# EasyEDA Pro project CL_LFR_V2.epro

# Schematic Schematic2
Board Name: Board1; Create Date: 2025-03-08; Page Name: P1; Project Name: LFR_RobotV2_PCB; Schematic Name: Schematic2; Update Date: 2025-03-08; Company: EasyEDA.com; Page Size: A4; Version: V1.0
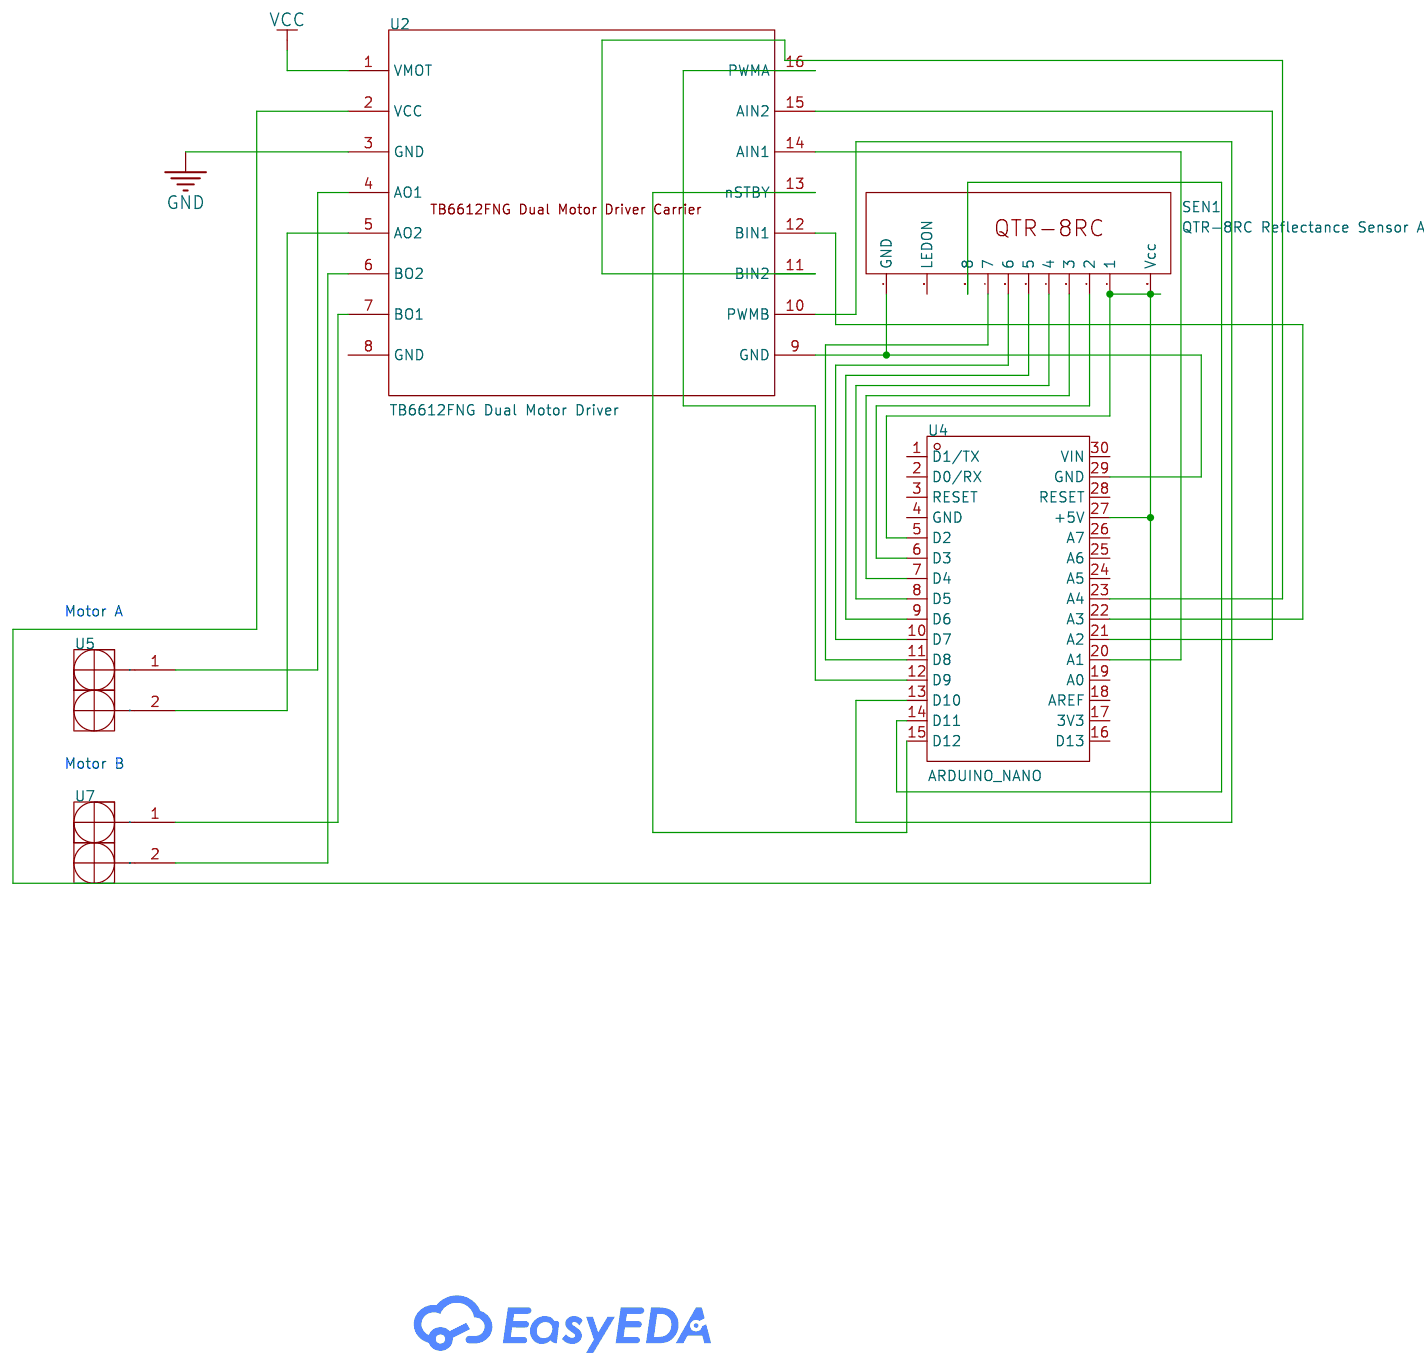
[diagram p0: schematic sheet]

## Parts
SEN1  QTR-8RC Reflectance Sensor Array  [QTR-8X]
U2  TB6612FNG Dual Motor Driver  [TB6612FNG]
U4  ARDUINO_NANO  [COMM-TH_ARDUINO_NANO]
U5  -  [2PIN SCREW TERMINAL]
U7  -  [2PIN SCREW TERMINAL]

## Library data of the parts
SEN1 = QTR-8RC Reflectance Sensor Array: Manufacturer: Pololu; Supplier: Pololu; Supplier Part: 961; link: https://www.pololu.com/product/961
U2 = TB6612FNG Dual Motor Driver: Mounted: Yes
U4 = ARDUINO_NANO: Supplier Part: C9900017879; Supplier Footprint: 插件; JLCPCB Part Class: Extended Part; Supplier: LCSC
U5 U7 = 2PIN SCREW TERMINAL

## Nets
GND: U2.3(GND)
VCC: U2.1(VMOT)
Net-(SEN1-1): SEN1.1 SEN1.10(Vcc) U2.2(VCC) U4.5(D2) U4.27(+5V)
Net-(SEN1-2): SEN1.2 U4.6(D3)
Net-(SEN1-3): SEN1.3 U4.7(D4)
Net-(SEN1-4): SEN1.4 U4.8(D5)
Net-(SEN1-5): SEN1.5 U4.9(D6)
Net-(SEN1-6): SEN1.6 U4.10(D7)
Net-(SEN1-7): SEN1.7 U4.11(D8)
Net-(SEN1-8): SEN1.8 U4.14(D11)
Net-(SEN1-11): SEN1.11(GND) U2.9(GND) U4.29(GND)
Net-(U2-4): U2.4(AO1) U5.1
Net-(U2-5): U2.5(AO2) U5.2
Net-(U2-6): U2.6(BO2) U7.2
Net-(U2-7): U2.7(BO1) U7.1
Net-(U2-10): U2.10(PWMB) U4.13(D10)
Net-(U2-11): U2.11(BIN2) U4.23(A4)
Net-(U2-12): U2.12(BIN1) U4.22(A3)
Net-(U2-13): U2.13(nSTBY) U4.15(D12)
Net-(U2-14): U2.14(AIN1) U4.20(A1)
Net-(U2-15): U2.15(AIN2) U4.21(A2)
Net-(U2-16): U2.16(PWMA) U4.12(D9)

Not connected (* = marked no-connect by the designer): SEN1 9(LEDON); U2 8(GND); U4 1(D1/TX) 2(D0/RX) 3(RESET) 4(GND) 16(D13) 17(3V3) 18(AREF) 19(A0) 24(A5) 25(A6) 26(A7) 28(RESET) 30(VIN)

## Notes on the sheet
- Motor A
- Motor B

# Board LFR_RobotV2_PCB
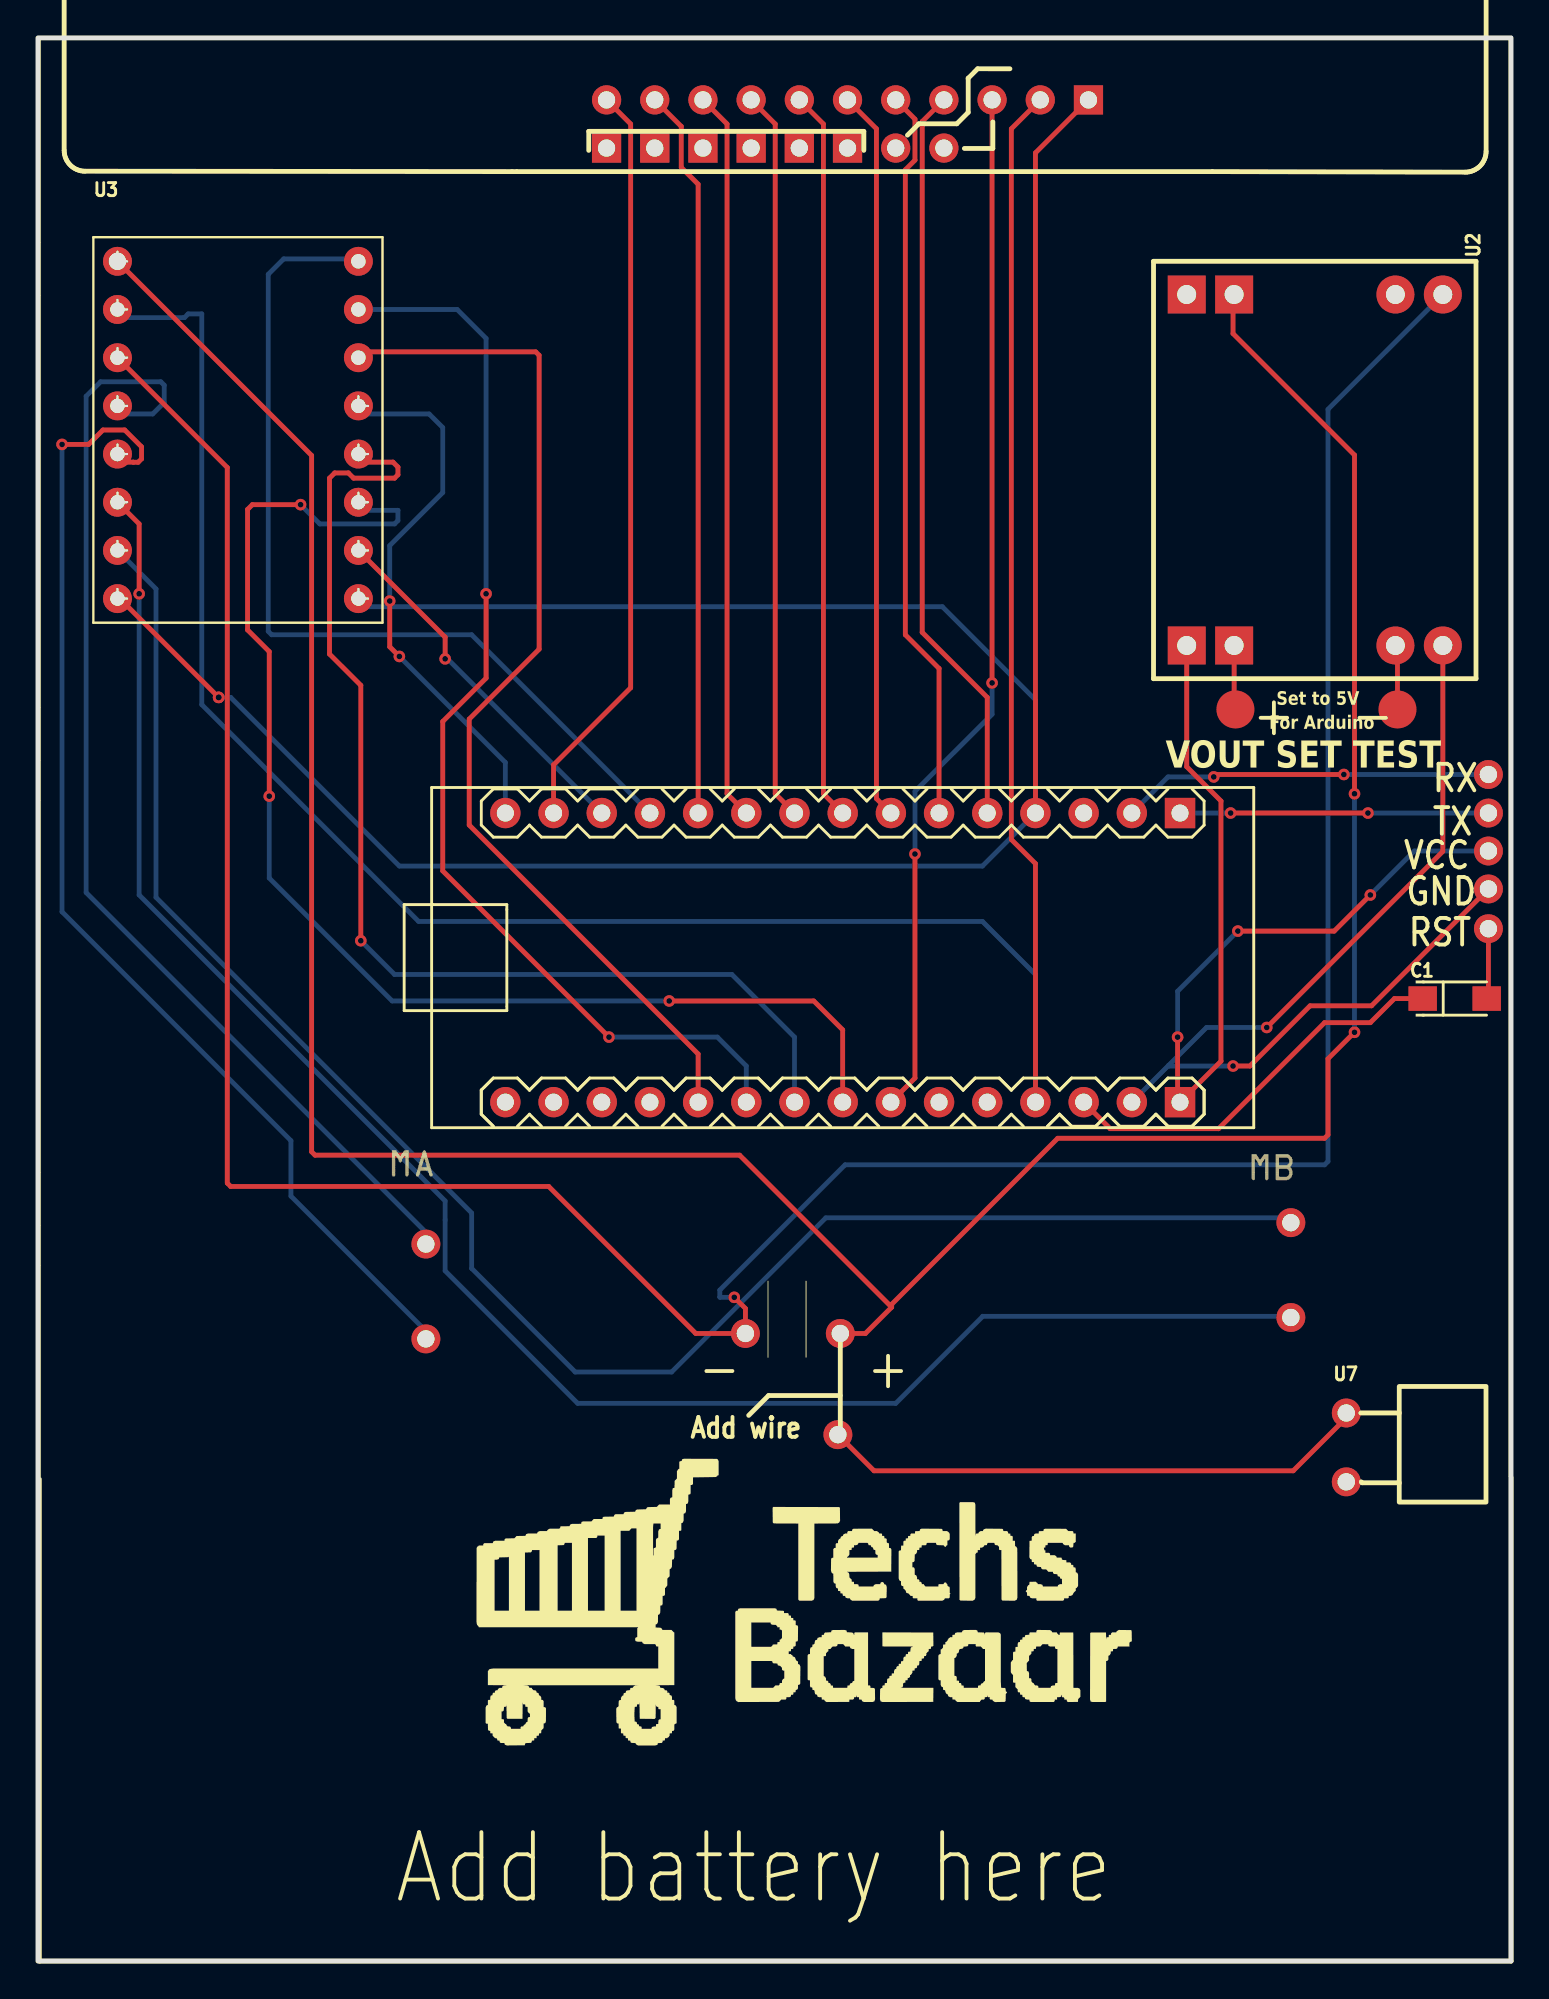
[diagram p1: board, top side]
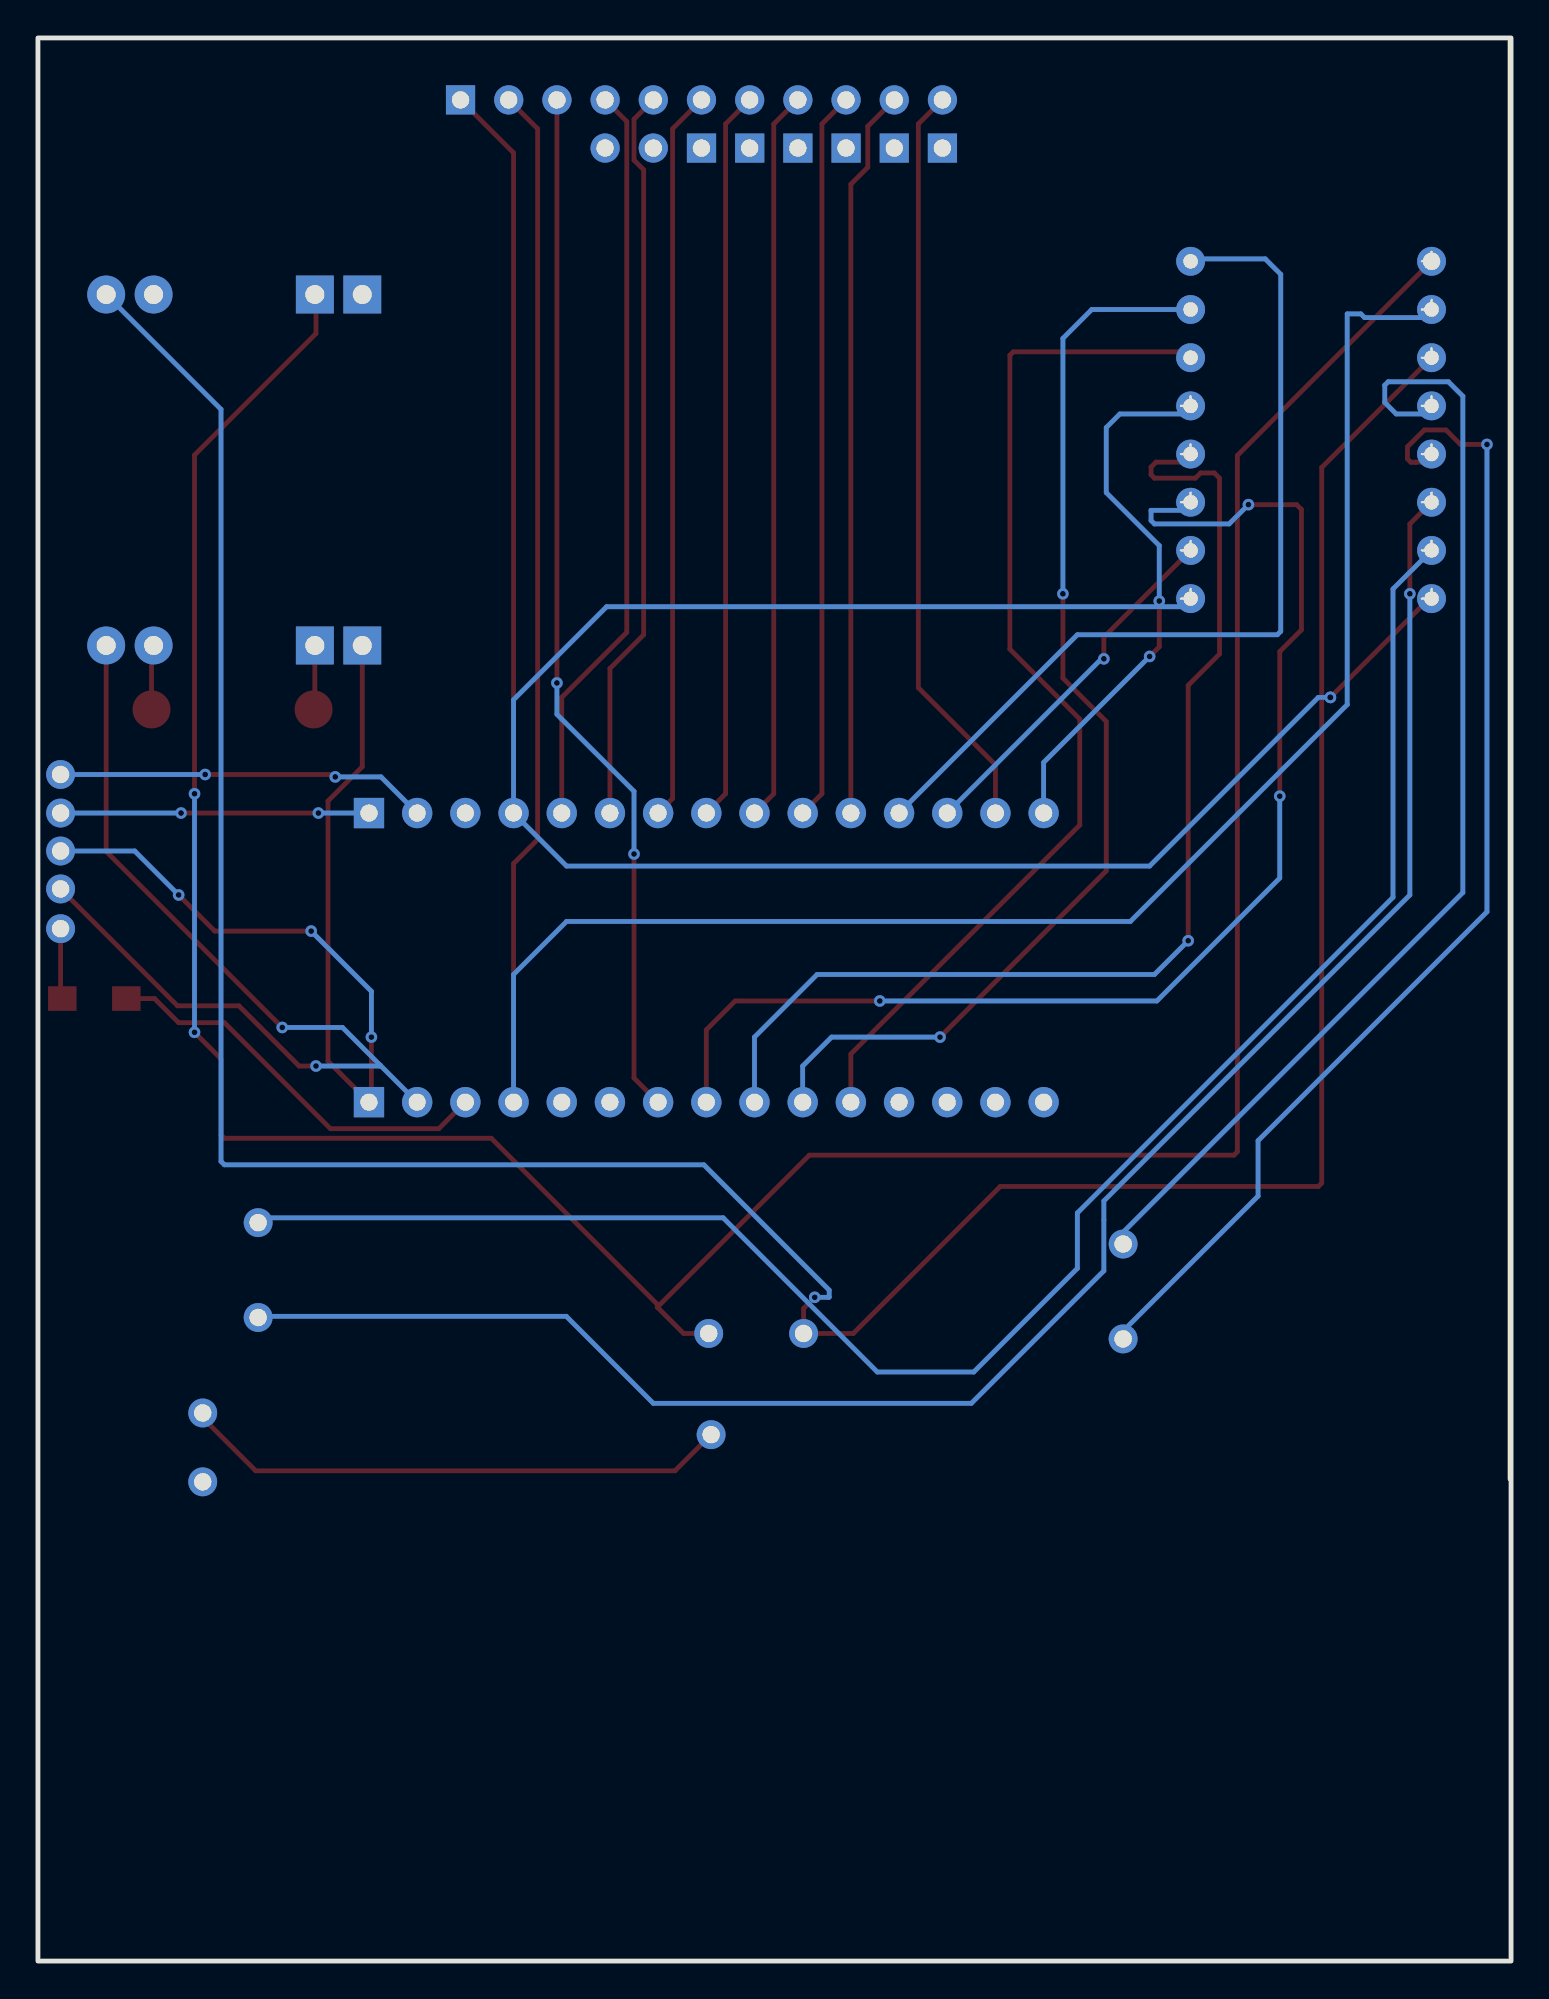
[diagram p2: board, bottom side, seen from below]

Outline 77.65 x 101.37 mm; copper layers: Top Layer, Bottom Layer. Coordinates in mm from the lower left corner of the outline.
Outline path: rectangle 0,101.37 77.65,0
Stack: Top Layer 0.035mm / Dielectric1 1.51mm FR4 er 4.5 / Bottom Layer 0.035mm

## Design rules (mm)
template: User Custom Config
spacing safeClearance (default): track to track 0.152, other pairs 0.008 to 0.3
track width trackWidth (default): min 0.127, default 0.254, max 2.54
differential pair differentialPair (default): width min 0.127, default 0.254, max 2.54; gap min 0.152, default 0.152
via viaSize (default): diameter min 0.5, default 0.61, max 10; hole min 0.3, default 0.305, max 5.999

## Placement (name value [footprint] x y rotation side)
C1  100nF  [CAP-SMD_L3.2-W1.6-RD]  74.68 50.74 0 top
NOREF  -  [Pad_e430]  76.45 58.51 0 top
NOREF#2  -  [Pad_e234]  63.12 65.98 0 top
NOREF#3  -  [Pad_e431]  76.45 56.51 0 top
NOREF#4  -  [Pad_e235]  71.66 65.98 0 top
NOREF#5  -  [Pad_e429]  76.45 60.51 0 top
NOREF#6  -  [Pad_e140]  76.45 54.42 0 top
NOREF#7  -  [Pad_e33]  42.16 27.75 0 top
NOREF#8  -  [Pad_e428]  76.45 62.55 0 top
SEN1  QTR-8RC Reflectance Sensor Array  [QTR-8X]  2.03 87.95 0 top
U1  ARDUINO_NANO  [COMM-TH_ARDUINO_NANO]  42.42 52.89 0 top
U2  TB6612FNG Dual Motor Driver  [MP1584 BREAKOUT]  58.8 89.6 270 top
U3  TB6612FNG Dual Motor Driver  [TB6612FNG]  2.79 70.55 0 top
U4  ARDUINO_NANO  [2PIN SCREW TERMINAL]  20.45 37.8 270 bottom
U5  -  [2PIN SCREW TERMINAL]  66.04 38.92 270 bottom
U6  -  [2PIN SCREW TERMINAL]  42.29 33.08 180 bottom
U7  Switch  [SwitchOnOff]  74.04 27.11 0 top

## Footprints (pads in the part's own frame, mm; a bottom-side part is the same pattern mirrored in y, then rotated)
2PIN SCREW TERMINAL
  round 1.524 hole 0.914: 1(0,0) 2(5,0)
CAP-SMD_L3.2-W1.6-RD
  rect 1.5x1.296 smd: 1(-1.687,0) 2(1.687,0)
COMM-TH_ARDUINO_NANO
  rect 1.6x1.6 hole 0.9: 1(17.78,7.62) 30(17.78,-7.62)
  round 1.6 hole 0.9: 2(15.24,7.62) 3(12.7,7.62) 4(10.16,7.62) 5(7.62,7.62) 6(5.08,7.62) 7(2.54,7.62) 8(0,7.62) 9(-2.54,7.62) 10(-5.08,7.62) 11(-7.62,7.62) 12(-10.16,7.62) 13(-12.7,7.62) 14(-15.24,7.62) 15(-17.78,7.62) 16(-17.78,-7.62) 17(-15.24,-7.62) 18(-12.7,-7.62) 19(-10.16,-7.62) 20(-7.62,-7.62) 21(-5.08,-7.62) 22(-2.54,-7.62) 23(0,-7.62) 24(2.54,-7.62) 25(5.08,-7.62) 26(7.62,-7.62) 27(10.16,-7.62) 28(12.7,-7.62) 29(15.24,-7.62)
MP1584 BREAKOUT
  round 2 hole 1: 1(1.75,15.25) 1(1.75,12.75) 3(20.25,15.25) 3(20.25,12.75)
  rect 2x2 hole 1: 2(1.75,4.25) 2(1.75,1.75) 4(20.25,4.25) 4(20.25,1.75)
Pad_e33
  round 1.524 hole 0.914: 1(0,0)
Pad_e140
  round 1.524 hole 0.914: 1(0,0)
Pad_e234
  round 2 smd: TP1(0,0)
Pad_e235
  round 2 smd: TP2(0,0)
Pad_e428
  round 1.524 hole 0.914: 1(0,0)
Pad_e429
  round 1.524 hole 0.914: 2(0,0)
Pad_e430
  round 1.524 hole 0.914: 3(0,0)
Pad_e431
  round 1.524 hole 0.914: 4(0,0)
QTR-8X
  rect 1.54x1.54 hole 0.91: (27.94,7.62) (30.48,7.62) (33.02,7.62) (35.56,7.62) (38.1,7.62) (40.64,7.62) 11(53.34,10.16)
  round 1.54 hole 0.91: (43.18,7.62) (45.72,7.62) 1(45.72,10.16) 2(43.18,10.16) 3(40.64,10.16) 4(38.1,10.16) 5(35.56,10.16) 6(33.02,10.16) 7(30.48,10.16) 8(27.94,10.16) 9(48.26,10.16) 10(50.8,10.16)
SwitchOnOff
  round 1.524 hole 0.914: 1(-5.08,1.778) 2(-5.08,-1.852)
TB6612FNG
  round 1.524 hole 0.914: 1(1.397,19.05)
  round 1.524 hole 0.762: 2(1.397,16.51) 3(1.397,13.97) 4(1.397,11.43) 5(1.397,8.89) 6(1.397,6.35) 7(1.397,3.81) 8(1.397,1.27) 9(14.097,1.27) 10(14.097,3.81) 11(14.097,6.35) 12(14.097,8.89) 13(14.097,11.43) 14(14.097,13.97) 15(14.097,16.51) 16(14.097,19.05)

## Nets
As in the schematic.

Pads without a net: C1 1 2; NOREF 3; NOREF#2 TP1; NOREF#3 4; NOREF#4 TP2; NOREF#5 2; NOREF#6 1; NOREF#7 1; NOREF#8 1; SEN1 1 2 3 4 5 6 7 8 9 10 11; U1 1 2 3 4 5 6 7 8 9 10 11 12 13 14 15 16 17 18 19 20 21 22 23 24 25 26 27 28 29 30; U2 1 2 3 4; U3 1 2 3 4 5 6 7 8 9 10 11 12 13 14 15 16; U4 1 2; U5 1 2; U6 1 2; U7 1 2

## Via types
v1: diameter 0.61, hole 0.305, Top Layer to Bottom Layer, 39 vias

## Routing (per net, layer and track width the routed paths; a pad name or vN(x,y) marks a point on that pad's centre or on a via; arc(x,y) is an arc through that point)
(no net): length 1812.1
  Top Layer w0.254: 45,34.47 43.62,33.08 v1(42.29,33.08) ; 45,34.47 45,34.62 53.75,43.37 67.82,43.37 68,43.55 68,47.56 v1(69.39,48.96) ; 45,34.47 36.99,42.48 14.61,42.48 14.43,42.66 14.43,79.36 4.62,89.17 ; U2.3 71.66,69.24 NOREF#4.TP2 ; v1(70.1,60.51) v1(62.87,60.51) ; v1(60.55,69.35) 60.55,62.96 62.36,61.15 62.36,47.43 U1.30 60.07,45.4 v1(60.07,48.7) ; v1(61.98,62.42) 62.1,62.55 v1(68.83,62.55) ; U1.6 47.5,68.13 45.72,69.91 45.72,94.42 46.23,94.93 46.23,97.09 SEN1.2 ; v1(69.39,61.53) 69.39,79.38 62.99,85.79 62.99,87.79 U2.2 ; v1(74.05,69.35) 74.05,58.49 v1(64.77,49.21) ; U3.14 17.2,84.82 26.24,84.82 26.42,84.64 26.42,69.15 22.73,65.47 22.73,59.88 34.8,47.81 U1.20 ; SEN1.3 44.2,96.58 44.2,61.28 U1.7 ; U1.8 41.4,61.53 41.4,96.84 SEN1.4 ; U2.4 63.05,65.98 NOREF#2.TP1 ; v1(70.23,56.2) 68.33,54.29 v1(63.25,54.29) ; NOREF#6.1 76.45,50.83 C1.2 ; v1(62.99,47.18) 63.88,47.18 67.06,50.35 70.29,50.35 NOREF#3.4 ; v1(52.58,60.51) 52.58,95.31 SEN1.11 ; v1(18.54,71.69) 18.54,69.28 v1(19.05,68.77) ; 4.62,71.39 4.74,71.39 v1(9.53,66.61) ; v1(17.02,53.78) 17.02,67.25 15.37,68.9 15.37,78.17 15.64,78.44 16.36,78.44 16.64,78.17 18.8,78.17 18.98,78.35 18.98,78.75 18.71,79.01 17.32,79.01 ; NOREF#7.1 44.07,25.84 66.17,25.84 68.96,28.64 68.96,28.89 ; U1.28 56.52,43.88 62.23,43.88 67.82,49.47 70.23,49.47 71.5,50.74 C1.1 ; v1(52.58,45.27) 52.58,57.85 51.31,59.12 51.31,96.58 SEN1.10 ; SEN1.8 31.24,96.84 31.24,67.12 27.18,63.05 U1.14 ; v1(23.62,72.07) 23.62,67.63 21.34,65.34 21.34,57.47 v1(30.1,48.7) ; v1(36.7,34.99) 37.29,34.4 v1(37.29,33.08) 34.67,33.08 26.92,40.83 10.16,40.83 9.98,41.01 9.98,78.73 4.62,84.09 ; SEN1.1 46.61,96.96 46.61,70.04 50.04,66.61 U1.5 ; U1.23 42.42,49.08 40.89,50.61 v1(33.27,50.61) ; v1(21.46,68.64) 21.46,69.79 17.32,73.93 ; U1.10 36.32,61.53 36.32,96.84 SEN1.6 ; 4.62,76.47 5.33,75.75 v1(5.33,72.07) ; SEN1.7 33.91,96.71 33.91,94.55 34.8,93.66 U1.11 ; v1(46.23,58.36) 46.23,46.54 U1.24 ; SEN1.9 v1(50.29,67.37) ; v1(39.88,60.51) 38.86,61.53 38.86,96.84 SEN1.5 ; v1(12.19,61.4) 12.19,69.02 11.05,70.17 11.05,76.52 11.3,76.77 v1(13.84,76.77) ; 4.62,79.01 5.02,79.01 5.03,79 5.28,79 5.46,79.18 5.46,79.82 4.57,80.71 3.43,80.71 2.67,79.95 v1(1.27,79.95)
  Bottom Layer w0.254: v1(62.99,47.18) 59.64,47.18 59.6,47.22 ; v1(69.39,48.96) v1(69.39,61.53) ; 59.6,47.22 U1.29 ; 59.6,47.22 61.59,49.21 v1(64.77,49.21) ; U1.13 21.59,68.64 v1(21.46,68.64) ; U3.16 16.76,89.72 12.95,89.72 12.14,88.91 12.14,70.09 12.32,69.91 22.86,69.91 v1(32.26,60.51) ; U1.2 59.56,62.42 v1(61.98,62.42) ; U1.22 39.88,48.7 36.58,52.01 18.8,52.01 v1(17.02,53.78) ; v1(52.58,45.27) 52.58,52.01 49.78,54.8 20.07,54.8 8.64,66.23 8.64,86.83 7.92,86.83 7.72,86.63 4.62,86.63 ; v1(36.7,34.99) 35.96,34.99 35.94,35 35.94,35.37 42.55,41.97 67.82,41.97 68,42.15 68,81.79 v1(74.05,87.85) ; v1(30.1,48.7) 35.81,48.7 37.34,47.18 U1.21 ; U1.15 24.64,63.18 v1(19.05,68.77) ; v1(13.84,76.77) 14.86,75.75 18.8,75.75 18.98,75.93 18.98,76.46 18.97,76.47 17.32,76.47 ; 17.32,71.39 47.67,71.39 52.58,66.48 v1(52.58,60.51) 49.78,57.72 19.05,57.72 10.16,66.61 v1(9.53,66.61) ; v1(5.33,72.07) 5.33,56.2 21.46,40.07 21.46,36.38 28.45,29.4 45.21,29.4 49.8,33.98 65.98,33.98 U5.2 ; 4.62,73.93 6.22,72.33 6.22,56.07 22.86,39.43 22.86,36.51 28.32,31.05 33.4,31.05 41.53,39.18 65.79,39.18 U5.1 ; 17.32,81.55 20.62,81.55 21.34,80.83 21.34,77.41 18.54,74.61 v1(18.54,71.69) ; v1(12.19,61.4) 12.19,57.09 18.67,50.61 v1(33.27,50.61) ; v1(46.23,58.36) 46.23,61.66 50.29,65.72 v1(50.29,67.37) ; v1(76.45,62.55) v1(68.83,62.55) ; NOREF#5.2 v1(70.1,60.51) ; v1(70.23,56.2) 72.55,58.51 NOREF.3 ; v1(62.87,60.51) U1.1 ; U4.2 20.45,33.21 13.34,40.32 13.34,43.24 1.27,55.31 v1(1.27,79.95) ; v1(63.25,54.29) 60.07,51.12 v1(60.07,48.7) ; v1(16.89,87.06) 22.1,87.06 23.62,85.53 v1(23.62,72.07) ; 4.62,81.55 6.05,81.55 6.66,82.16 6.66,83.07 6.48,83.25 3.3,83.25 2.54,82.49 2.54,56.32 20.45,38.42 U4.1

## Text on the board
Top Silkscreen Layer: Add wire | RST | VCC | GND | RX | TX | - | + | Add battery here | For Arduino | Set to 5V | VOUT SET TEST
